# EAGLE design Controller (EAGLE 6.2)
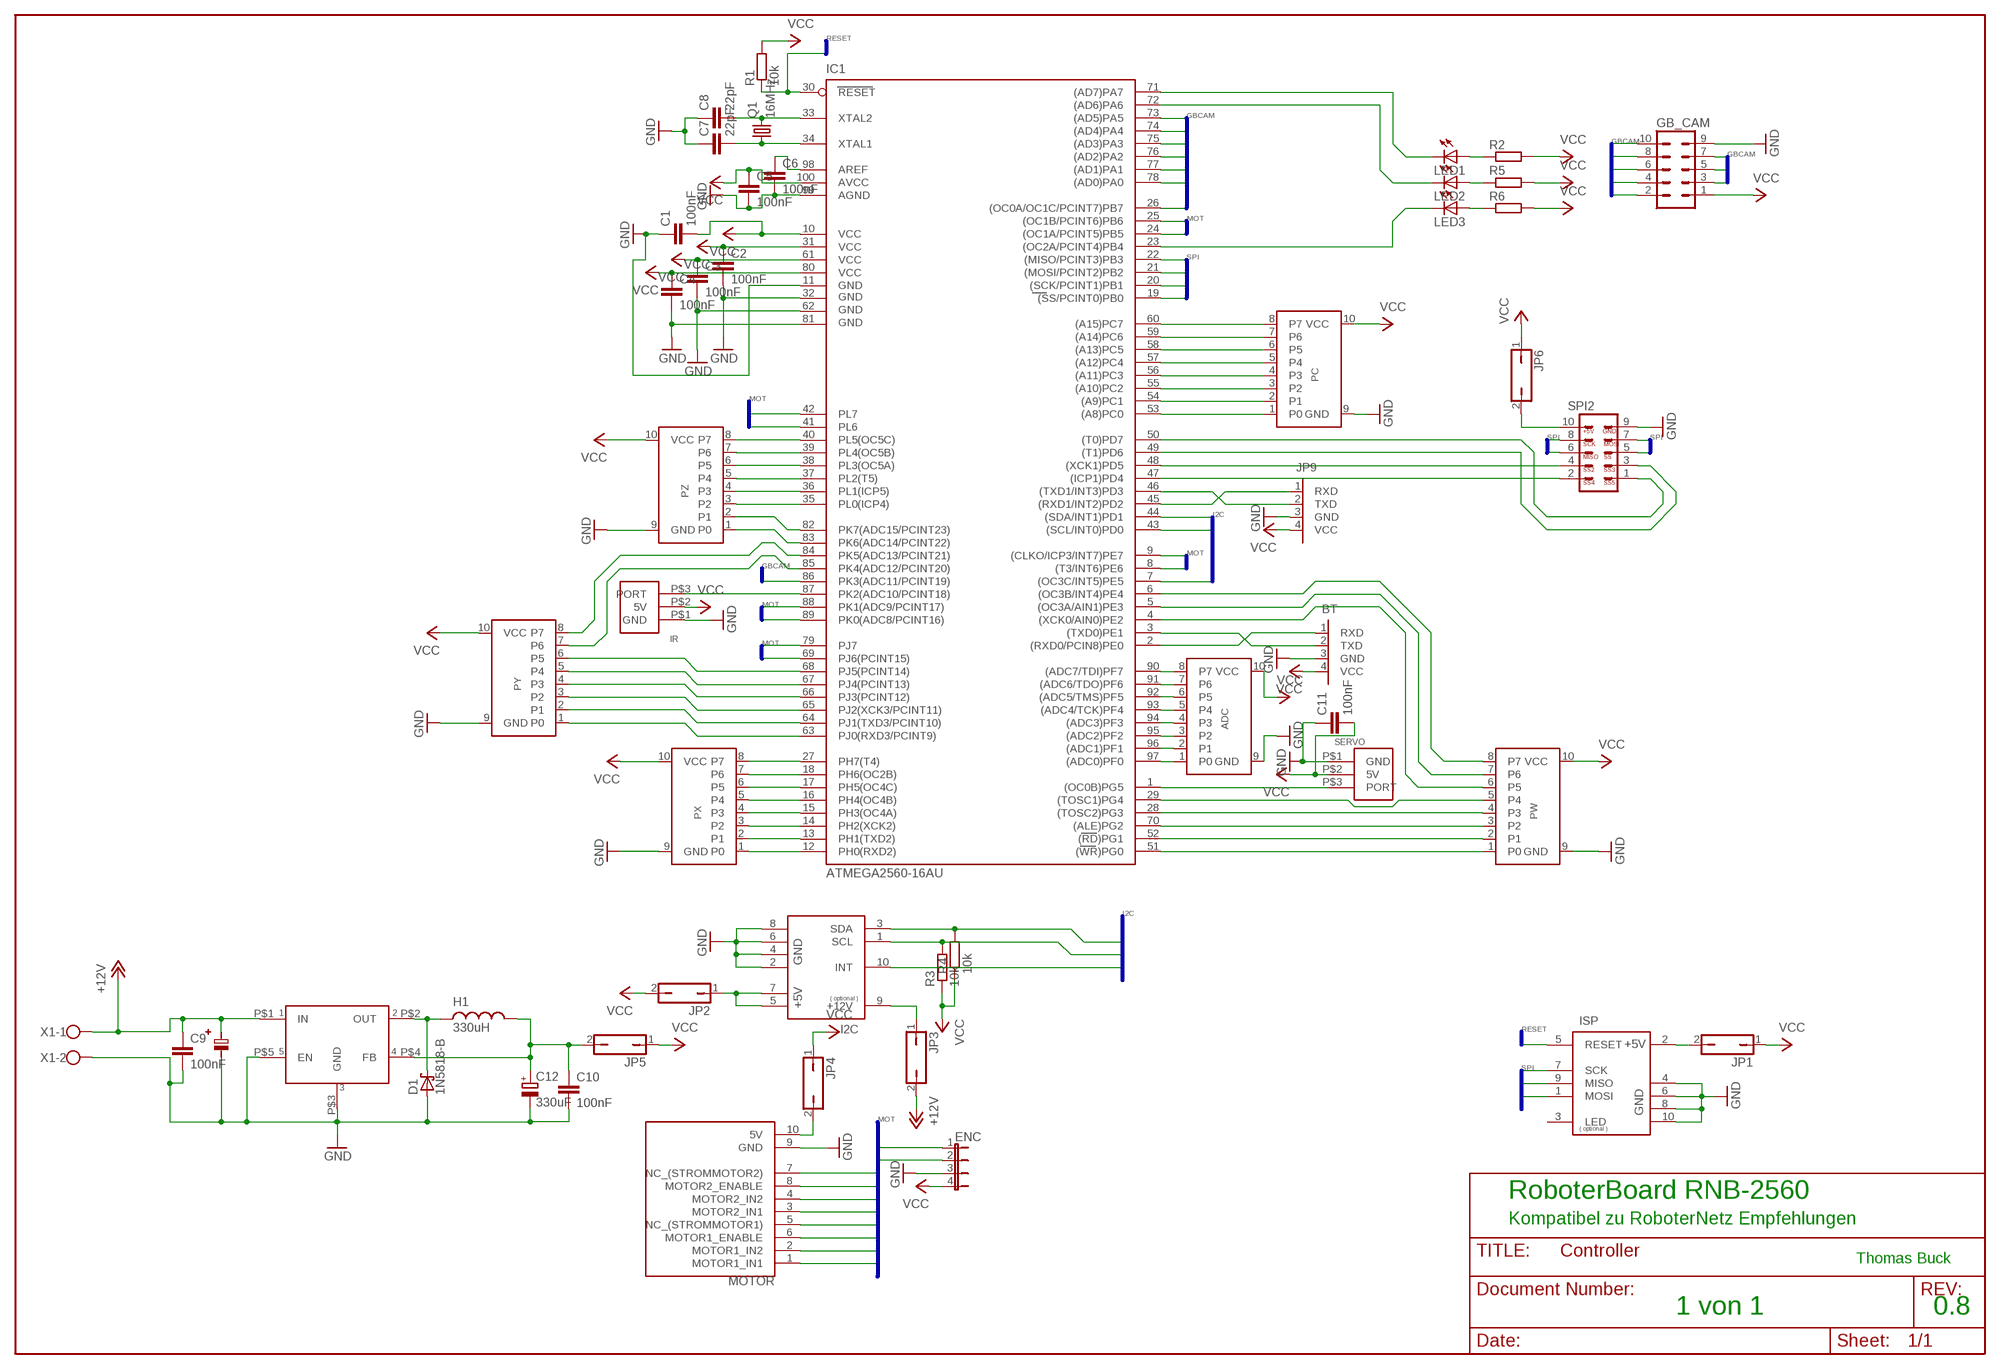
[diagram p0: schematic, sheet 1]

## Parts
ADC  PORT  [ML10]
BT  RS232_TTL  [1X04]
C1  100nF  C-EUC0603  [C0603]
C2  100nF  C-EUC0603  [C0603]
C3  100nF  C-EUC0603  [C0603]
C4  100nF  C-EUC0603  [C0603]
C5  100nF  C-EUC0603  [C0603]
C6  100nF  C-EUC0603  [C0603]
C7  22pF  C-EUC0603  [C0603]
C8  22pF  C-EUC0603  [C0603]
C9  100nF  C-EUC0603  [C0603]
C10  100nF  C-EUC0603  [C0603]
C11  100nF  C-EUC0603  [C0603]
C12  330uF  CPOL-EUF  [PANASONIC_F]
D1  1N5818-B  [DO41-7.6]
ENC  JP4E  [JP4]
GB_CAM  ML10  [ML10]
H1  330uH  PISR_SPULE  [PISR]
I2C  I2C  [ML10]
IC1  ATMEGA2560-16AU  [TQFP100]
IR  UNIPORT3POL  [1X3SERVO]
ISP  AVR-ISP  [ML10]
JP1  JP1Q  [JP1]
JP2  JP1Q  [JP1]
JP3  JP1Q  [JP1]
JP4  JP1Q  [JP1]
JP5  JP1Q  [JP1]
JP6  JP1Q  [JP1]
JP9  RS232_TTL  [1X04]
LED1  LEDCHIP-LED0603  [CHIP-LED0603]
LED2  LEDCHIP-LED0603  [CHIP-LED0603]
LED3  LEDCHIP-LED0603  [CHIP-LED0603]
LM2576-5  LM2576  [TO-220]
MOTOR  MOTORSTTCKER10POLRNNORM  [ML10]
PC  PORT  [ML10]
PW  PORT  [ML10]
PX  PORT  [ML10]
PY  PORT  [ML10]
PZ  PORT  [ML10]
Q1  16MHz  CRYSTALHC49S  [HC49/S]
R1  10k  R-EU_R0603  [R0603]
R2  R-EU_R0603  [R0603]
R3  10k  R-EU_R0603  [R0603]
R4  10k  R-EU_R0603  [R0603]
R5  R-EU_R0603  [R0603]
R6  R-EU_R0603  [R0603]
SERVO  UNIPORT3POL  [1X3SERVO]
SPI2  SPISTECKER  [ML10]
U$1  100uF  ELKO  [ELKO_SMD_6.5]
X1  W237-102  [W237-102]

## Nets
+12V: C9.1 JP3.2 LM2576-5.P$1(IN) U$1.P$2 X1.1
ANALOG: GB_CAM.8 IC1.86(PK3(ADC11/PCINT19))
CLK: GB_CAM.6 IC1.77((AD1)PA1)
DATA: GB_CAM.3 IC1.74((AD4)PA4)
DATASET: GB_CAM.4 IC1.75((AD3)PA3)
DREHL: ENC.1 IC1.9((CLKO/ICP3/INT7)PE7)
DREHR: ENC.2 IC1.8((T3/INT6)PE6)
GND: ADC.9(GND) BT.3(GND) C1.1 C2.2 C3.2 C4.2 C5.2 C6.2 C7.1 C8.1 C9.2 C10.2 C11.1 C12.- D1.A ENC.3 GB_CAM.9 I2C.2(GND) I2C.4(GND) I2C.6(GND) I2C.8(GND) IC1.11(GND) IC1.32(GND1) IC1.62(GND2) IC1.81(GND3) IC1.99(AGND) IR.P$1(GND) ISP.4(GND) ISP.6(GND) ISP.8(GND) ISP.10(GND) JP9.3(GND) LM2576-5.P$3(GND) LM2576-5.P$5(EN) MOTOR.9(GND) PC.9(GND) PW.9(GND) PX.9(GND) PY.9(GND) PZ.9(GND) SERVO.P$1(GND) SPI2.9 U$1.P$1 X1.2
IN1L: IC1.42(PL7) MOTOR.1(MOTOR1_IN1)
IN1R: IC1.79(PJ7) MOTOR.3(MOTOR2_IN1)
IN2L: IC1.41(PL6) MOTOR.2(MOTOR1_IN2)
IN2R: IC1.69(PJ6(PCINT15)) MOTOR.4(MOTOR2_IN2)
INT: I2C.10(INT) IC1.7((OC3C/INT5)PE5)
MISO: IC1.22((MISO/PCINT3)PB3) ISP.9(MISO) SPI2.6
MOSI: IC1.21((MOSI/PCINT2)PB2) ISP.1(MOSI) SPI2.7
N$1: IC1.87(PK2(ADC10/PCINT18)) IR.P$3(PORT)
N$2: C6.1 IC1.98(AREF)
N$3: C8.2 IC1.33(XTAL2) Q1.2
N$4: C7.2 IC1.34(XTAL1) Q1.1
N$5: IC1.1((OC0B)PG5) SERVO.P$3(PORT)
N$6: IC1.60((A15)PC7) PC.8(P7)
N$7: IC1.59((A14)PC6) PC.7(P6)
N$8: IC1.58((A13)PC5) PC.6(P5)
N$9: IC1.57((A12)PC4) PC.5(P4)
N$10: IC1.56((A11)PC3) PC.4(P3)
N$11: IC1.55((A10)PC2) PC.3(P2)
N$12: IC1.54((A9)PC1) PC.2(P1)
N$13: IC1.53((A8)PC0) PC.1(P0)
N$14: IC1.12(PH0(RXD2)) PX.1(P0)
N$15: IC1.13(PH1(TXD2)) PX.2(P1)
N$16: IC1.14(PH2(XCK2)) PX.3(P2)
N$17: IC1.15(PH3(OC4A)) PX.4(P3)
N$18: IC1.16(PH4(OC4B)) PX.5(P4)
N$19: IC1.17(PH5(OC4C)) PX.6(P5)
N$20: IC1.18(PH6(OC2B)) PX.7(P6)
N$21: IC1.27(PH7(T4)) PX.8(P7)
N$22: IC1.40(PL5(OC5C)) PZ.8(P7)
N$23: IC1.39(PL4(OC5B)) PZ.7(P6)
N$24: IC1.38(PL3(OC5A)) PZ.6(P5)
N$25: IC1.37(PL2(T5)) PZ.5(P4)
N$26: IC1.36(PL1(ICP5)) PZ.4(P3)
N$27: IC1.35(PL0(ICP4)) PZ.3(P2)
N$28: IC1.82(PK7(ADC15/PCINT23)) PZ.2(P1)
N$29: IC1.83(PK6(ADC14/PCINT22)) PZ.1(P0)
N$30: IC1.63(PJ0(RXD3/PCINT9)) PY.1(P0)
N$31: IC1.64(PJ1(TXD3/PCINT10)) PY.2(P1)
N$32: IC1.65(PJ2(XCK3/PCINT11)) PY.3(P2)
N$33: IC1.66(PJ3(PCINT12)) PY.4(P3)
N$34: IC1.67(PJ4(PCINT13)) PY.5(P4)
N$35: IC1.68(PJ5(PCINT14)) PY.6(P5)
N$36: IC1.85(PK4(ADC12/PCINT20)) PY.7(P6)
N$37: IC1.84(PK5(ADC13/PCINT21)) PY.8(P7)
N$38: IC1.51((WR)PG0) PW.1(P0)
N$39: IC1.52((RD)PG1) PW.2(P1)
N$40: IC1.70((ALE)PG2) PW.3(P2)
N$41: IC1.28((TOSC2)PG3) PW.4(P3)
N$42: IC1.29((TOSC1)PG4) PW.5(P4)
N$43: IC1.4((XCK0/AIN0)PE2) PW.6(P5)
N$44: IC1.5((OC3A/AIN1)PE3) PW.7(P6)
N$45: IC1.6((OC3B/INT4)PE4) PW.8(P7)
N$46: JP6.2 SPI2.10
N$47: IC1.47((ICP1)PD4) SPI2.2
N$48: IC1.48((XCK1)PD5) SPI2.4
N$49: IC1.50((T0)PD7) SPI2.1
N$50: IC1.23((OC2A/PCINT4)PB4) LED3.C
N$51: IC1.72((AD6)PA6) LED2.C
N$52: IC1.71((AD7)PA7) LED1.C
N$53: IC1.49((T1)PD6) SPI2.3
N$54: ISP.2(+5V) JP1.2
N$55: I2C.5(+5V) I2C.7(+5V) JP2.1
N$56: I2C.9(+12V) JP3.1
N$57: JP4.2 MOTOR.10(5V)
N$58: ADC.8(P7) IC1.90((ADC7/TDI)PF7)
N$59: LED1.A R2.1
N$60: LED2.A R5.1
N$61: LED3.A R6.1
N$62: ADC.7(P6) IC1.91((ADC6/TDO)PF6)
N$63: ADC.6(P5) IC1.92((ADC5/TMS)PF5)
N$64: D1.C H1.P$1 LM2576-5.P$2(OUT)
N$65: ADC.5(P4) IC1.93((ADC4/TCK)PF4)
N$66: ADC.4(P3) IC1.94((ADC3)PF3)
N$67: ADC.3(P2) IC1.95((ADC2)PF2)
N$68: ADC.2(P1) IC1.96((ADC1)PF1)
N$69: ADC.1(P0) IC1.97((ADC0)PF0)
N$71: IC1.46((TXD1/INT3)PD3) JP9.2(TXD)
N$72: IC1.45((RXD1/INT2)PD2) JP9.1(RXD)
N$80: C10.1 C12.+ H1.P$2 JP5.2 LM2576-5.P$4(FB)
PWML: IC1.25((OC1B/PCINT6)PB6) MOTOR.6(MOTOR1_ENABLE)
PWMR: IC1.24((OC1A/PCINT5)PB5) MOTOR.8(MOTOR2_ENABLE)
READIMG: GB_CAM.7 IC1.78((AD0)PA0)
RESET: IC1.30(RESET) ISP.5(RESET) R1.1
RX: BT.1(RXD) IC1.2((RXD0/PCIN8)PE0)
SCK: IC1.20((SCK/PCINT1)PB1) ISP.7(SCK) SPI2.8
SCL: I2C.1(SCL) IC1.43((SCL/INT0)PD0) R3.2
SDA: I2C.3(SDA) IC1.44((SDA/INT1)PD1) R4.2
SENSL: IC1.88(PK1(ADC9/PCINT17)) MOTOR.5(NC_(STROMMOTOR1))
SENSR: IC1.89(PK0(ADC8/PCINT16)) MOTOR.7(NC_(STROMMOTOR2))
SERVO: GB_CAM.10 IC1.26((OC0A/OC1C/PCINT7)PB7)
SS: IC1.19((SS/PCINT0)PB0) SPI2.5
START: GB_CAM.2 IC1.73((AD5)PA5)
SYSRES: GB_CAM.5 IC1.76((AD2)PA2)
TX: BT.2(TXD) IC1.3((TXD0)PE1)
VCC: ADC.10(VCC) BT.4(VCC) C1.2 C2.1 C3.1 C4.1 C5.1 C11.2 ENC.4 GB_CAM.1 IC1.10(VCC) IC1.31(VCC1) IC1.61(VCC2) IC1.80(VCC3) IC1.100(AVCC) IR.P$2(5V) JP1.1 JP2.2 JP4.1 JP5.1 JP6.1 JP9.4(VCC) PC.10(VCC) PW.10(VCC) PX.10(VCC) PY.10(VCC) PZ.10(VCC) R1.2 R2.2 R3.1 R4.1 R5.2 R6.2 SERVO.P$2(5V)
Unconnected: ISP.3(LED)

## Buses
PWML,PWMR,IN1L,IN2L,IN1R,IN2R,DREHL,DREHR,SENSL,SENSR
SDA,SCL,INT
SS,MOSI,MISO,SCK
RESET
START,DATA,DATASET,SYSRES,CLK,READIMG,ANALOG,SERVO

## Notes on the sheet
- RESET
- GBCAM
- GBCAM
- GBCAM
- MOT
- SPI
- MOT
- SPI | SPI
- I2C
- MOT
- GBCAM
- MOT
- MOT
- I2C
- RESET
- SPI
- MOT
- RoboterBoard RNB-2560
- Kompatibel zu RoboterNetz Empfehlungen
- Thomas Buck
- 1 von 1 | 0.8

## Library data of the parts
ADC PC PW PX PY PZ = 0-roboternetz-definitionen:PORT: Datenportstecker Kompatibel zu den Steckern des STK500
BT JP9 = 0-roboternetz-definitionen:RS232_TTL: RS232 Stecker TTL-Pegel ( für externe Pegelwandler für RS485 o.ä. )
C1-C11 = resistor:C-EU: CAPACITOR, European symbol
C12 = resistor:CPOL-EU: POLARIZED CAPACITOR, European symbol
D1 = diode:1N581*: 1.0A SCHOTTKY BARRIER RECTIFIER Source: http://www.diodes.com/datasheets/ds23001.pdf
ENC = jumper:JP4E: JUMPER
GB_CAM = con-harting-ml:ML10: HARTING; OC_FARNELL: unknown; OC_NEWARK: unknown
H1 = 0-xythobuz:PISR_SPULE: SMD Spule/Drossel
I2C = 0-roboternetz-definitionen:I2C: I2C Bus Stecker Ein universeller serieller Bus für Erweiterungen. Der Bus hat den Vorteil das zwei Leitungen ausreichen und keine festen Taktraten und Zyklen beachtet werden müssen. Zahlreichen integrierten Schaltkreise ( wie Porterweiterungen, LCD-Treiber, usw. ) nutzen diesen Bus. Am I2C-Bus können mehrere Karten/Bausteine angeschlossen (durchgeschleift) werden, da jeder Baustein seine Slave Adresse besitzt. Der hier definierte Standard ist kompatibel ( wenn man Pin 10 unbeschaltet lässt ) zum Elektor-Standard ( Elektronik Zeitrschrift ).
IC1 = 0-atmel-2005:ATMEGA*: MICROCONTROLLER 64/128/256 Kbytes FLASH 4 Kbytes EEPROM 8 Kbytes SRAM 86 General Purpose I/O pins 12-channels16-bit PWM 4 x Serial USARTs 16-channels 10-bit A/D
IR SERVO = 0-robotikhardware:UNIPORT3POL
ISP = 0-roboternetz-definitionen:AVR-ISP: ISP ( In System Programming ) Stecker für AVRs Über diesen Anschluß kann ein AVR mit einem Standard ISP-Kabel direkt an einen Parallelport des PC´s angeschlossen und programmiert werden. Die Belegung des ISP-Anschlusses ist zu dem weit verbreitetet STK200 Programmier Dongle kompatibel. Ein entsprechender Dongle ist über zahlreiche Händler lieferbar. Es gibt aber auch viele Selbstbauanleitungen im Internet.
JP1-JP6 = jumper:JP1Q: JUMPER
LED1-LED3 = led:LED: LED OSRAM: - CHIPLED LG R971, LG N971, LY N971, LG Q971, LY Q971, LO R971, LY R971 LH N974, LH R974 LS Q976, LO Q976, LY Q976 LO Q996 - Hyper CHIPLED LW Q18S LB Q993, LB Q99A, LB R99A - SideLED LS A670, LO A670, LY A670, LG A670, LP A670 LB A673, LV A673, LT A673, LW A673 LH A674 LY A675 LS A676, LA A676, LO A676, LY A676, LW A676 LS A679, LY A679, LG A679 - Hyper Micro SIDELED® LS Y876, LA Y876, LO Y876, LY Y876 LT Y87S - SmartLED LW L88C, LW L88S LB L89C, LB L89S, LG L890 LS L89K, LO L89K, LY L89K LS L896, LA L896, LO L896, LY L896 - TOPLED LS T670, LO T670, LY T670, LG T670, LP T670 LSG T670, LSP T670, LSY T670, LOP T670, LYG T670 LG T671, LOG T671, LSG T671 LB T673, LV T673, LT T673, LW T673 LH T674 LS T676, LA T676, LO T676, LY T676, LB T676, LH T676, LSB T676, LW T676 LB T67C, LV T67C, LT T67C, LS T67K, LO T67K, LY T67K, LW E67C LS E67B, LA E67B, LO E67B, LY E67B, LB E67C, LV E67C, LT E67C LW T67C LS T679, LY T679, LG T679 LS T770, LO T770, LY T770, LG T770, LP T770 LB T773, LV T773, LT T773, LW T773 LH T774 LS E675, LA E675, LY E675, LS T675 LS T776, LA T776, LO T776, LY T776, LB T776 LHGB T686 LT T68C, LB T68C - Hyper Mini TOPLED® LB M676 - Mini TOPLED Santana® LG M470 LS M47K, LO M47K, LY M47K Source: http://www.osram.convergy.de LUXEON: - LUMILED® LXK2-PW12-R00, LXK2-PW12-S00, LXK2-PW14-U00, LXK2-PW14-V00 LXK2-PM12-R00, LXK2-PM12-S00, LXK2-PM14-U00 LXK2-PE12-Q00, LXK2-PE12-R00, LXK2-PE12-S00, LXK2-PE14-T00, LXK2-PE14-U00 LXK2-PB12-K00, LXK2-PB12-L00, LXK2-PB12-M00, LXK2-PB14-N00, LXK2-PB14-P00, LXK2-PB14-Q00 LXK2-PR12-L00, LXK2-PR12-M00, LXK2-PR14-Q00, LXK2-PR14-R00 LXK2-PD12-Q00, LXK2-PD12-R00, LXK2-PD12-S00 LXK2-PH12-R00, LXK2-PH12-S00 LXK2-PL12-P00, LXK2-PL12-Q00, LXK2-PL12-R00 Source: www.luxeon.com KINGBRIGHT: KA-3528ASYC Source: www.kingbright.com
LM2576-5 = 0-xythobuz:LM2576: LM2576 Schaltregler ´
MOTOR = 0-robotikhardware:MOTORSTTCKER10POLRNNORM
Q1 = crystal:CRYSTAL: CRYSTAL; OC_FARNELL: 1667008; OC_NEWARK: unknown
R1-R6 = resistor:R-EU_: RESISTOR, European symbol
SPI2 = 0-robotikhardware:SPISTECKER
U$1 = 0-xythobuz:ELKO: Elektrolyt Kondensator
X1 = con-wago-500:W237-102: WAGO SCREW CLAMP; MPN: 237-102; OC_FARNELL: unknown; OC_NEWARK: 70K9898

## Net classes
1 Power4A: width 1.143 mm
2 Power2A: width 0.762 mm
3 Power3A: width 1.016 mm

## Board
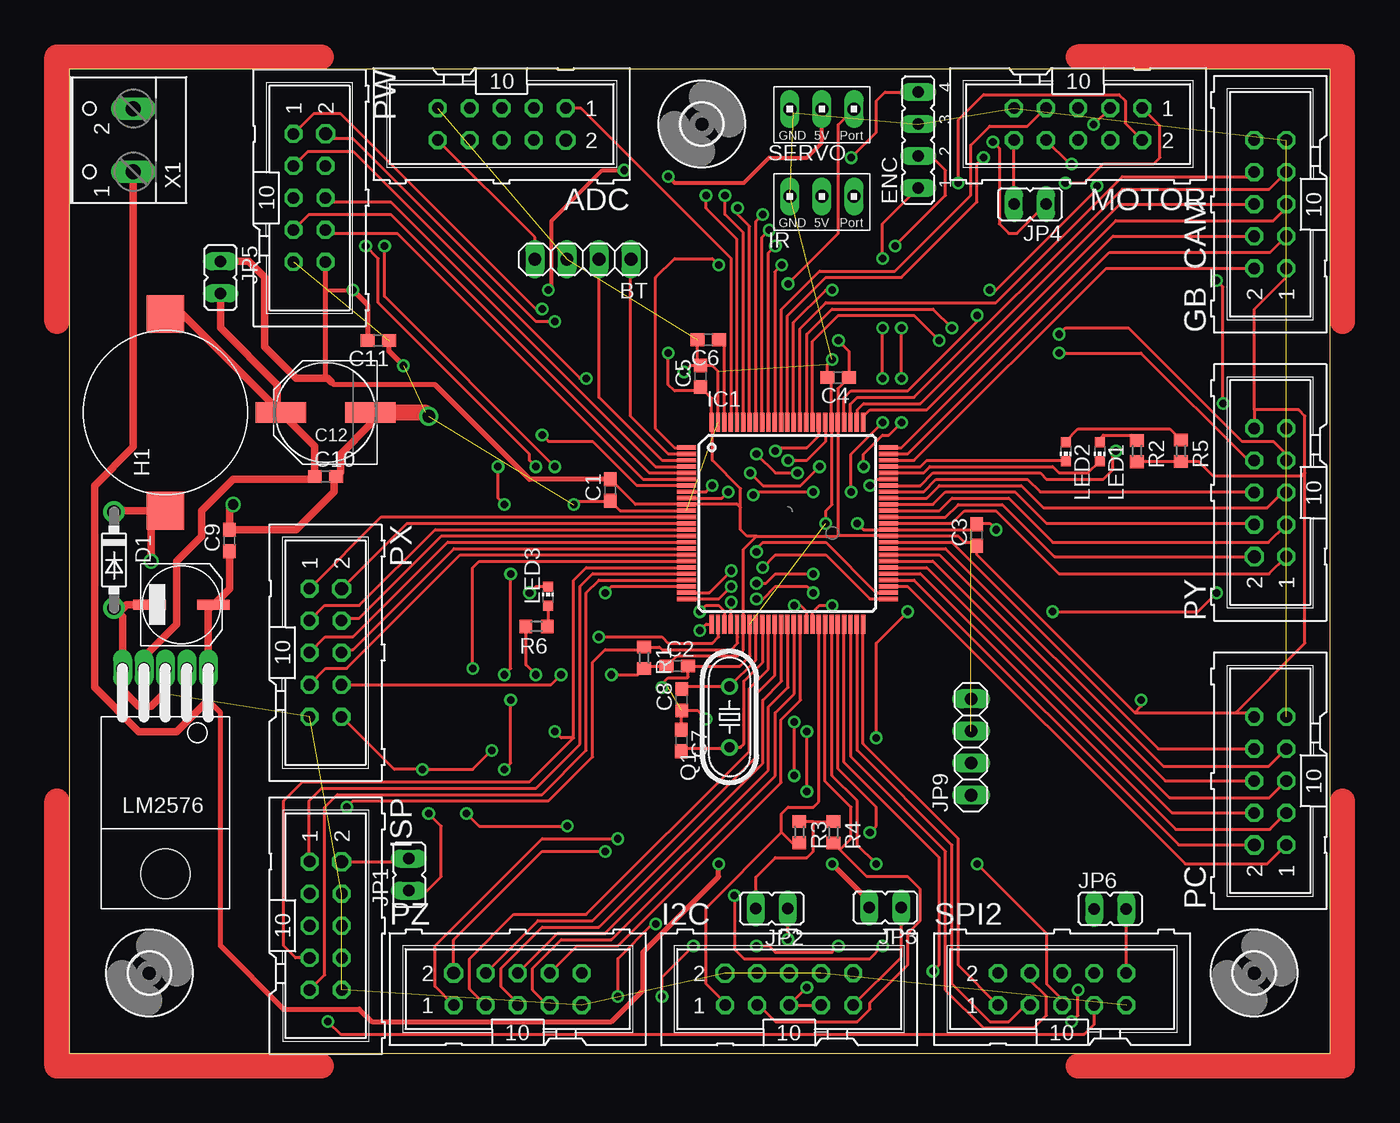
[diagram p1: board, top side]
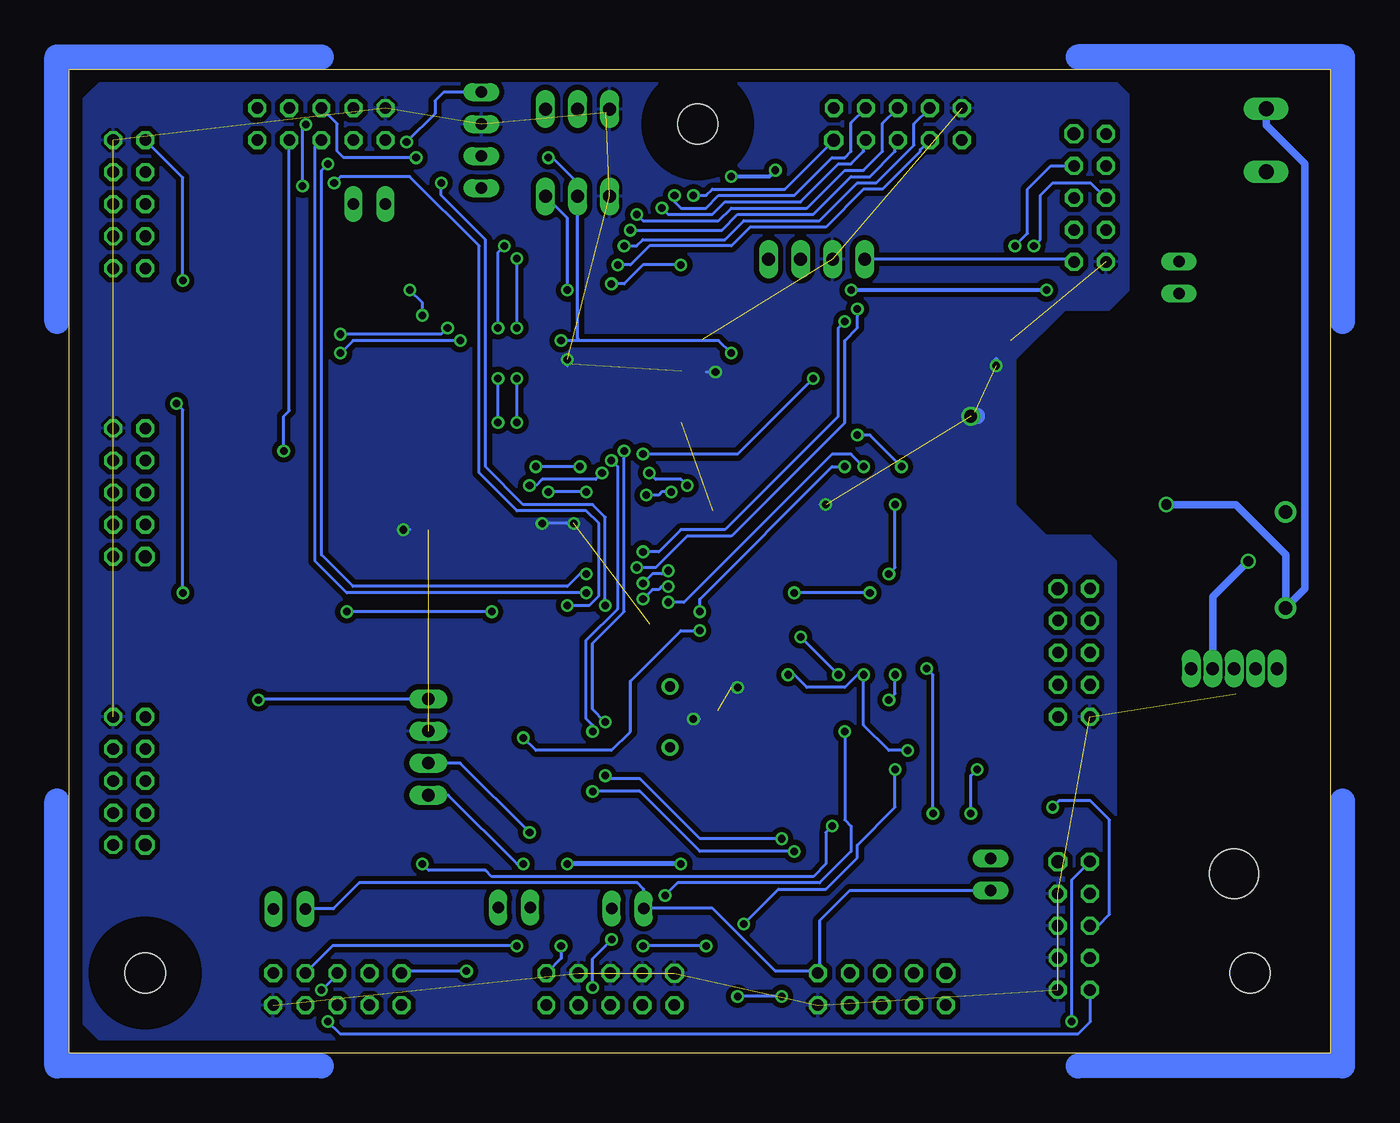
[diagram p2: board, bottom side, seen from below]

Size 100 x 78 mm. Coordinates in mm from the lower left corner, seen from the top.
Outline: 0,0 100,0 100,78 0,78 0,0
Copper layers (1*16): Top 0.035mm / dielectric 1.5mm / Bottom 0.035mm
Design rules: minimum track width 0.25mm, minimum drill 0.6mm, track to track 0.15mm, track to pad 0.15mm, pad to pad 0.15mm, via to via 0.15mm, smd to smd 0.15mm, copper to edge 40mil, drill to drill 8mil, minimum pad ring 10mil, minimum via ring 8mil, stop-mask expansion 4mil, vias tented up to drill 0mil, thermal gap 10mil

### Footprints (pad centres in the part's own frame; a part is rotated, then mirrored left to right if it is on the bottom)
ML10 = drill 0.914 pad 1.422 octagon: 1 -5.08,-1.27; 3 -2.54,-1.27; 4 -2.54,1.27 | drill 1.016 pad 1.422 octagon: 2 -5.08,1.27 | drill 0.914 octagon: 5 0,-1.27; 6 0,1.27; 7 2.54,-1.27; 8 2.54,1.27; 9 5.08,-1.27; 10 5.08,1.27
1X04 = drill 1.016 long: 1 -3.81,0; 2 -1.27,0; 3 1.27,0; 4 3.81,0
C0603 = smd 1.1 x 1: 1 -0.85,0; 2 0.85,0
PANASONIC_F = smd 4 x 1.6: + 3.55,0; - -3.55,0
DO41-7.6 = drill 1.1 pad 1.7: A 3.81,0; C -3.81,0
JP4 = drill 0.914 long: 1 -3.81,0; 2 -1.27,0; 3 1.27,0; 4 3.81,0
ML10' = drill 0.914 octagon: 1 -5.08,-1.27; 2 -5.08,1.27; 3 -2.54,-1.27; 4 -2.54,1.27; 5 0,-1.27; 6 0,1.27; 7 2.54,-1.27; 8 2.54,1.27; 9 5.08,-1.27; 10 5.08,1.27
PISR = smd 3 x 3: P$1 -7.8,0; P$2 7.8,0
TQFP100 = smd 1.5 x 0.35: 1 -8,6; 2 -8,5.5; 3 -8,5; 4 -8,4.5; 5 -8,4; 6 -8,3.5; 7 -8,3; 8 -8,2.5; 9 -8,2; 10 -8,1.5; 11 -8,1; 12 -8,0.5; 13 -8,0; 14 -8,-0.5; 15 -8,-1; 16 -8,-1.5; 17 -8,-2; 18 -8,-2.5; 19 -8,-3; 20 -8,-3.5; 21 -8,-4; 22 -8,-4.5; 23 -8,-5; 24 -8,-5.5; 25 -8,-6; 51 8,-6; 52 8,-5.5; 53 8,-5; 54 8,-4.5; 55 8,-4; 56 8,-3.5; 57 8,-3; 58 8,-2.5; 59 8,-2; 60 8,-1.5; 61 8,-1; 62 8,-0.5; 63 8,0; 64 8,0.5; 65 8,1; 66 8,1.5; 67 8,2; 68 8,2.5; 69 8,3; 70 8,3.5; 71 8,4; 72 8,4.5; 73 8,5; 74 8,5.5; 75 8,6 | smd 0.35 x 1.5: 26 -6,-8; 27 -5.5,-8; 28 -5,-8; 29 -4.5,-8; 30 -4,-8; 31 -3.5,-8; 32 -3,-8; 33 -2.5,-8; 34 -2,-8; 35 -1.5,-8; 36 -1,-8; 37 -0.5,-8; 38 0,-8; 39 0.5,-8; 40 1,-8; 41 1.5,-8; 42 2,-8; 43 2.5,-8; 44 3,-8; 45 3.5,-8; 46 4,-8; 47 4.5,-8; 48 5,-8; 49 5.5,-8; 50 6,-8; 76 6,8; 77 5.5,8; 78 5,8; 79 4.5,8; 80 4,8; 81 3.5,8; 82 3,8; 83 2.5,8; 84 2,8; 85 1.5,8; 86 1,8; 87 0.5,8; 88 0,8; 89 -0.5,8; 90 -1,8; 91 -1.5,8; 92 -2,8; 93 -2.5,8; 94 -3,8; 95 -3.5,8; 96 -4,8; 97 -4.5,8; 98 -5,8; 99 -5.5,8; 100 -6,8
1X3SERVO = drill 1.016 long: P$1 -2.54,0; P$2 0,0; P$3 2.54,0
JP1 = drill 0.914 long: 1 0,-1.27; 2 0,1.27
CHIP-LED0603 = smd 0.8 x 0.8: A 0,-0.75; C 0,0.75
TO-220 = drill 1 long: P$1 -3.404,-8.89; P$2 -1.702,-8.89; P$3 0,-8.89; P$4 1.702,-8.89; P$5 3.404,-8.89 | hole 3.912: 0,7.366
HC49/S = drill 0.813: 1 -2.413,0; 2 2.413,0
R0603 = smd 1 x 1.1: 1 -0.85,0; 2 0.85,0
ELKO_SMD_6.5 = smd 2.6 x 0.8: P$1 -2.54,0; P$2 2.54,0
3,2 = hole 3.2: 0,0
W237-102 = drill 1.194 long: 1 -2.5,-1.27; 2 2.5,-1.27

### Placement (x,y rotation side)
ADC  34.29,73.66 180 top
BT  40.73,62.94 180 top
C1  42.91,44.64 90 top
C2  48.22,30.69 0 top
C3  71.96,41.07 90 top
C4  60.98,53.56 180 top
C5  50.06,53.67 90 top
C6  50.68,56.56 180 top
C7  48.54,24.78 270 top
C8  48.56,28.02 90 top
C9  12.7,40.64 90 top
C10  20.32,45.72 0 top
C11  24.5,56.5 180 top
C12  20.32,50.8 180 top
D1  3.54,39.1 270 top
ENC  67.31,72.39 90 top
GB_CAM  [ML10']  95.25,67.31 90 top
H1  7.62,50.8 90 top
I2C  57.09,5.07 0 top
IC1  56.95,42.01 0 top
IR  59.69,67.93 0 top
ISP  20.33,10.1 270 top
JP1  26.93,14.16 0 top
JP2  55.72,11.48 90 top
JP3  64.72,11.56 90 top
JP4  76.2,67.31 90 top
JP5  12,61.5 180 top
JP6  82.55,11.43 270 top
JP9  71.52,24.27 90 top
LED1  81.72,47.68 180 top
LED2  79.03,47.68 180 top
LED3  37.96,36.22 0 top
LM2576-5  7.62,21.59 180 top
MOTOR  [ML10']  80.01,73.66 180 top
PC  95.25,21.59 90 top
PW  19.05,67.81 270 top
PX  20.32,31.75 270 top
PY  95.25,44.45 90 top
PZ  35.56,5.08 0 top
Q1  52.36,26.66 90 top
R1  45.59,31.35 270 top
R2  84.67,47.74 270 top
R3  57.89,17.53 270 top
R4  60.59,17.51 270 top
R5  88.17,47.75 270 top
R6  37.06,33.83 180 top
SERVO  59.69,74.85 0 top
SPI2  [ML10']  78.74,5.08 0 top
U$1  8.89,35.56 0 top
U$2  [3,2]  6.35,6.35 0 top
U$3  [3,2]  50.16,73.66 0 top
U$4  [3,2]  93.98,6.35 0 top
X1  3.81,72.39 90 top

### Tracks (layer width: path | path; a pad name or v marks a point on that pad's centre or on a via)
+12V  (via drill 0.6)
  Top 0.406: JP3.2 63.45,12.05 v60.5,15 | v51.5,15 51.5,14 45.5,8 45.5,5 43,2.5 24,2.5 23,3.5 17,3.5 12,8.5 12,27 11,28
  Top 0.61: X1.1 5.08,48.08 2,45 2,29 5.5,25.5 8.5,25.5 11,28 11,30.46 LM2576-5.P$1 11.02,35.15 U$1.P$2 12.7,36.83 C9.1
  Bottom 0.406: v51.5,15 v60.5,15
ANALOG
  Top 0.25: IC1.86 57.95,57.45 60,59.5 73.5,59.5 83.5,69.5 93.63,69.5 GB_CAM.8
CLK
  Top 0.25: GB_CAM.6 83.31,67.31 67.5,51.5 63,51.5 62.5,51 62.5,50.06 IC1.77
DATA
  Top 0.25: IC1.74 66.51,47.51 82.5,63.5 95.25,63.5 GB_CAM.3
DATASET
  Top 0.25: GB_CAM.4 82.77,64.77 66,48 IC1.75
DREHL  (via drill 0.6)
  Top 0.25: IC1.9 51.76,44.01 v52.25,44.5 | v54.25,44.25 54.5,44.5 v59,44.5 | v62,44.5 62,47.5 v64.5,50 | v64.5,53.5 v64.5,57.5 | v64.5,63 64.5,65.77 ENC.1
  Bottom 0.25: v52.25,44.5 53,44.5 53.25,44.25 v54.25,44.25 | v59,44.5 v62,44.5 | v64.5,50 v64.5,53.5 | v64.5,57.5 v64.5,63
DREHR  (via drill 0.6)
  Top 0.25: IC1.8 50.51,44.51 v51,45 | v54,46 55,45 58,45 v59.5,46.5 | v63,46.5 63,47.5 64.5,49 65,49 v66,50 | v66,53.5 v66,57.5 | v65.5,64 69.5,68 69.5,70 68.5,71 67.43,71 ENC.2
  Bottom 0.25: v51,45 51.5,45.5 53.5,45.5 v54,46 | v59.5,46.5 v63,46.5 | v66,50 v66,53.5 | v66,57.5 66,63.5 v65.5,64
GND  (via drill 0.6, 0.8, 1)  (28 unrouted)
  Top 0.25: IC1.62 71.55,41.51 C3.2 | IC1.62 71.51,41.51 72,42 73,42 v73.5,41.5 | SERVO.P$1 57.42,74.58 | C7.1 48.56,25.65 C8.1 49.83,27.17 v50.5,26.5 | IC1.32 54,33.96 54,31.5 53.19,30.69 C2.2 49.07,29.82 49,29.75 47.5,29.75 47,29.25 v47,29 | IC1.11 43.69,43.01 C1.1 42.96,43.79 43,43.75 40.25,43.75 v40,43.5 | IC1.99 51.45,54.05 51,54.5 50.08,54.5 | 50.08,54.5 C5.2 49.83,54.75 C6.2 | v60.5,55 60.13,54.63 C4.2 60.45,53.24 IC1.81 60.5,49.96 60.5,43.5 60,43 v60,42 | 50.08,54.5 49.25,54.5 v48.75,54 | C10.2 21,45.89 | IC1.62 62.99,41.51 v62.5,42
  Top 0.406: C11.1 25.35,55.65 v26.5,54.5
  Top 0.61: 3.92,34.91 4.22,34.61 LM2576-5.P$5 4.22,28.78 5.5,27.5 6.5,27.5 7.5,28.5 7.5,30.36 LM2576-5.P$3 | 3.92,34.91 D1.A | U$1.P$1 4.56,35.56 3.92,34.91 | v13,43.5 12.7,43.2 C9.2 17.99,41.49 21,44.5 21,45.55 C10.2 21.5,46.05 21.5,47.5 23.87,49.87 C12.-
  Top 1.27: C12.- 28.2,50.8 v28.5,50.5
  Bottom 0.25: v73.5,41.5 73,41.5 | v50.5,26.5 50,26.5 | v47,29 47.5,29 | v60.5,55 60.5,54.5 | v48.75,54 49.5,54 | v40,43.5 40.5,43.5 | v60,42 v62.5,42
  Bottom 0.406: v26.5,54.5 26.5,55
  Bottom 0.61: v13,43.5 7.5,43.5 3.5,39.5 3.5,35.33 D1.A 2,36.83 2,70.5 5.08,73.58 X1.2
  Bottom 1.27: v28.5,50.5 28,50.5
  pour Bottom (isolate 0.406): 17,39 19,41 22.5,41 25,43.5 25,55 21,59 17.5,59 16,60.5 16,76 17.5,77.5 97,77.5 99,75.5 99,2.5 97.5,1 17,1
IN1L  (via drill 0.6)
  Top 0.25: IC1.42 58.95,34.95 59.5,35.5 v60.5,35.5 | v79,69 80.5,69 82,70.5 86,70.5 86.5,71 86.5,73.52 MOTOR.1
  Bottom 0.25: v60.5,35.5 58.75,35.5 58,36.25 58,42 59,43 64.5,43 67.5,46 67.5,64 73,69.5 78.5,69.5 v79,69
IN1R  (via drill 0.6)
  Top 0.25: IC1.79 61.45,51.95 62,52.5 66.5,52.5 72,58 v72,58.5 | v73,60.5 73.5,60.5 81.5,68.5 v81.5,68.75 | v81.25,73.63 MOTOR.3
  Bottom 0.25: v72,58.5 72,59.5 v73,60.5 | v81.5,68.75 81.5,73.38 v81.25,73.63
IN2L  (via drill 0.6)
  Top 0.25: IC1.41 58.45,35.05 58,35.5 v57.5,35.5 | v70.5,69 70.5,74 72.5,76 83.25,76 83.75,75.5 83.75,73.73 MOTOR.2
  Bottom 0.25: v57.5,35.5 57.5,42.5 58.5,43.5 64,43.5 67,46.5 67,64.5 70.5,68 v70.5,69
IN2R  (via drill 0.6)
  Top 0.25: IC1.69 67.5,45 68.5,46 77,46 77.5,45.5 82,45.5 82.75,46.25 82.75,47.5 v83,47.75
  Bottom 0.25: v83,47.75 83,50.5 82.55,50.95 MOTOR.4
INT  (via drill 0.6)
  Top 0.25: IC1.7 44.99,45.01 41.5,48.5 38,48.5 v37.5,49 | v34,46.5 34,44 v34.5,43.5 | v35,38 35,30.5 v34.5,30 | v35,28 35,23 v34.5,22.5 | v54.5,8.5 55.5,8.5 56,8 60.5,8 v61,8.5 | v46.5,10.25 46.25,10.25 43.5,7.5 v43.5,4.5 | v47,4.5 47,6 v49.5,8.5
  Bottom 0.25: v37.5,49 36.5,49 v34,46.5 | v34.5,43.5 34.5,38.5 v35,38 | v34.5,30 34.5,28.5 v35,28 | v34.5,22.5 34.5,19.5 37.5,16.5 37.5,15.5 40,13 43.75,13 v46.5,10.25 | v49.5,8.5 v54.5,8.5 | v61,8.5 61,7.51 I2C.10 | v43.5,4.5 v47,4.5
MISO  (via drill 0.6)
  Top 0.25: IC1.22 42.01,37.51 41,36.5 41,24 37.5,20.5 21.25,20.5 20.25,19.5 20.25,6.21 ISP.9 | v80,5 80,3 v79.5,2.5
  Bottom 0.25: SPI2.6 78.74,6.26 v80,5 | v79.5,2.5 78.5,1.5 20,1.5 19,2.5 19,4.96 ISP.9
MOSI  (via drill 0.6)
  Top 0.25: IC1.21 41.51,38.01 40.5,37 40.5,24.5 37,21 20,21 19,20 19,15.24 ISP.1 | SPI2.7 81.28,2.28 80.5,1.5 21.5,1.5 v20.5,2.5
  Bottom 0.25: v20.5,2.5 20.5,13.74 ISP.1
N$1  (via drill 0.6)
  Top 0.25: IC1.87 57.45,57.95 60,60.5 v60.5,60.5
  Bottom 0.25: v60.5,60.5 60.5,66.2 IR.P$3
N$2
  Top 0.25: IC1.98 51.95,56.14 C6.1
N$3
  Top 0.25: IC1.33 54.45,31.16 Q1.2 48.76,29.07 C8.2
N$4
  Top 0.25: IC1.34 55,33.96 55,31 53.5,29.5 53.5,24.5 53.25,24.25 Q1.1 52.29,24.18 48.79,24.18 C7.2
N$5  (via drill 0.6)
  Top 0.25: IC1.1 47.99,48.01 46.5,49.5 46.5,61.5 48,63 51,63 v51.5,62.5 | v57,61 61,65 61,73.62 SERVO.P$3
  Bottom 0.25: v51.5,62.5 54.5,62.5 56,61 v57,61
N$6
  Top 0.25: PC.8 86.37,24.13 70,40.5 IC1.60
N$7
  Top 0.25: IC1.59 69.49,40.01 86.75,22.75 95.14,22.75 PC.7
N$8
  Top 0.25: PC.6 86.91,21.59 69,39.5 IC1.58
N$9
  Top 0.25: IC1.57 68.49,39.01 87.25,20.25 95.18,20.25 PC.5
N$10
  Top 0.25: PC.4 87.45,19.05 68,38.5 IC1.56
N$11
  Top 0.25: IC1.55 67.49,38.01 87.75,17.75 95.22,17.75 PC.3
N$12
  Top 0.25: PC.2 87.99,16.51 67,37.5 IC1.54
N$13
  Top 0.25: IC1.53 66.49,37.01 88.5,15 95.01,15 PC.1
N$14
  Top 0.25: IC1.12 24.73,42.51 PX.1
N$15
  Top 0.25: IC1.13 26.77,42.01 PX.2
N$16
  Top 0.25: IC1.14 29.01,41.51 23,35.5 20.26,35.5 PX.3
N$17
  Top 0.25: IC1.15 29.51,41.01 23,34.5 21.8,34.5 PX.4
N$18
  Top 0.25: IC1.16 30.01,40.51 22.5,33 20.3,33 PX.5
N$19
  Top 0.25: IC1.17 30.51,40.01 22.5,32 21.84,32 PX.6
N$20
  Top 0.25: IC1.18 31.01,39.51 22,30.5 20.34,30.5 PX.7
N$21  (via drill 0.6)
  Top 0.25: PX.8 38.21,29.21 v39,30 | v42,33 47,33 47.5,32.5 51,32.5 51.5,33 51.5,33.96 IC1.27
  Bottom 0.25: v39,30 v42,33
N$22
  Top 0.25: PZ.8 40.25,8.5 43.5,8.5 56.45,21.45 56.45,26.45 58,28 58,33.96 IC1.40
N$23
  Top 0.25: PZ.7 37.94,3.81 36.75,5 36.75,6.75 39,9 43,9 56,22 56,27 57.5,28.5 57.5,33.96 IC1.39
N$24
  Top 0.25: PZ.6 38.71,9.5 42.5,9.5 55.45,22.45 55.45,27.45 57,29 57,33.96 IC1.38
N$25
  Top 0.25: PZ.5 35.56,3.94 34.25,5.25 34.25,6.75 37.5,10 42,10 55,23 55,28 56.5,29.5 56.5,33.96 IC1.37
N$26
  Top 0.25: IC1.36 55.95,29.95 54.5,28.5 54.5,23.5 41.5,10.5 37.17,10.5 PZ.4
N$27
  Top 0.25: IC1.35 55.45,30.45 53.95,28.95 53.95,23.95 41,11 35.25,11 31.75,7.5 31.75,5.08 PZ.3
N$28  (via drill 0.6)
  Top 0.25: PZ.2 30.48,8.98 37.5,16 v42.5,16 | v57,47 58.5,47 60,48.5 60,49.96 IC1.82 | v58.5,20.75 v58.5,25.5
  Bottom 0.25: v42.5,16 50,16 54.75,20.75 v58.5,20.75 | v57,47 56.5,46.5 56.5,35.25 59,32.75 59,26.5 58.5,26 v58.5,25.5
N$29  (via drill 0.6)
  Top 0.25: IC1.83 59.45,48.95 58.5,48 56.25,48 v56,47.75 | v43.5,17 37.5,17 29,8.5 29,5.29 PZ.1 | v57.5,22 v57.5,26.25
  Bottom 0.25: v56,47.75 56,35 58.5,32.5 58.5,27.25 v57.5,26.25 | v43.5,17 50,17 54.75,21.75 57.25,21.75 v57.5,22
N$30
  Top 0.25: IC1.63 70.01,42.01 71,43 73.5,43 78.5,38 95.15,38 PY.1
N$31
  Top 0.25: PY.2 78.13,39.37 74,43.5 70.5,43.5 69.5,42.5 IC1.64
N$32
  Top 0.25: IC1.65 69.01,43.01 70,44 74.5,44 78,40.5 95.11,40.5 PY.3
N$33
  Top 0.25: IC1.66 68.51,43.51 69.5,44.5 75,44.5 77.5,42 93.89,42 PY.4
N$34
  Top 0.25: PY.5 96.2,44.45 95,43.25 77.25,43.25 75.5,45 69,45 68,44 IC1.67
N$35
  Top 0.25: IC1.68 67.76,44.51 68.75,45.5 76,45.5 77,44.5 93.93,44.5 PY.6
N$36  (via drill 0.6)
  Top 0.25: PY.7 96.52,47.48 95.5,48.5 93,48.5 84,57.5 79,57.5 v78.5,57 | v70,57.5 68.5,59 60.5,59 58.5,57 58.5,50.06 IC1.85
  Bottom 0.25: v78.5,57 70.5,57 v70,57.5
N$37  (via drill 0.6)
  Top 0.25: IC1.84 58.95,56.45 61,58.5 67,58.5 v69,56.5 | v78.5,55.5 85,55.5 93.5,47 PY.8
  Bottom 0.25: v69,56.5 77.5,56.5 v78.5,55.5
N$38  (via drill 0.6)
  Top 0.25: IC1.51 63.49,36.01 60,39.5 56,39.5 v55,38.5 | v37.5,59 37,59 21.5,74.5 19.39,74.5 PW.1
  Bottom 0.25: v55,38.5 53.5,38.5 51,41 47.5,41 38.5,50 38.5,56.5 37.5,57.5 v37.5,59
N$39  (via drill 0.6)
  Top 0.25: IC1.52 63.99,36.51 60,40.5 55,40.5 54.5,40 v54.5,39.75 | v38.5,58 37,58 22.5,72.5 20.71,72.5 PW.2
  Bottom 0.25: v54.5,39.75 53.25,39.75 51.5,41.5 48,41.5 39,50.5 39,57.5 v38.5,58
N$40  (via drill 0.6)
  Top 0.25: IC1.70 64.01,45.51 v63.5,45 | v57.75,46 56,46 v54.5,47.5 | v41,53.5 40.5,53.5 22.5,71.5 18.93,71.5 PW.3
  Bottom 0.25: v63.5,45 63,45 62.5,45.5 58.25,45.5 v57.75,46 | v54.5,47.5 47,47.5 v41,53.5
N$41  (via drill 0.6)
  Top 0.25: IC1.28 51.95,35.05 51.5,35.5 50.5,35.5 v50,35 | v25,64 25,60 v38.5,46.5
  Bottom 0.25: v50,35 50,36 39.5,46.5 v38.5,46.5 | PW.4 22.15,70.35 24,68.5 24,65 v25,64
N$42  (via drill 0.6)
  Top 0.25: IC1.29 52.45,35.7 v52.5,35.75 | v23.5,64 24.5,63 24.5,59.5 36.5,47.5 36.5,47 v37,46.5
  Bottom 0.25: v52.5,35.75 51.25,35.75 39.5,47.5 38,47.5 v37,46.5 | PW.5 17.81,67.81 19,69 22,69 23,68 23,64.5 v23.5,64
N$43
  Top 0.25: IC1.4 46.49,46.51 25.5,67.5 20.63,67.5 PW.6
N$44
  Top 0.25: IC1.5 45.99,46.01 25.5,66.5 19.01,66.5 PW.7
N$45
  Top 0.25: IC1.6 45.49,45.51 26,65 20.59,65 PW.8
N$46
  Top 0.25: SPI2.10 JP6.2
N$47  (via drill 0.6)
  Top 0.25: IC1.47 61.45,23.05 69,15.5 69,7 v68.5,6.5
  Bottom 0.25: v68.5,6.5 73.51,6.5 SPI2.2
N$48
  Top 0.25: SPI2.4 76.2,5.8 77.5,4.5 77.5,3 76.5,2 72.5,2 69.5,5 69.5,16 62,23.5 62,33.96 IC1.48
N$49
  Top 0.25: IC1.50 62.95,24.55 70.5,17 70.5,6.97 SPI2.1
N$50  (via drill 0.6)
  Top 0.25: LED3.C 36.97,36.97 v36.5,36.5 | v42.5,36.5 43,37 IC1.23
  Bottom 0.25: v36.5,36.5 v42.5,36.5
N$51
  Top 0.25: IC1.72 67.51,46.51 68,47 78.96,47 LED2.C
N$52
  Top 0.25: IC1.71 67.76,46.01 68.25,46.5 78,46.5 78.5,46 80.79,46 LED1.C
N$53
  Top 0.25: SPI2.3 75.81,3.81 74.5,2.5 73,2.5 70,5.5 70,16.5 62.5,24 62.5,33.96 IC1.49
N$54
  Top 0.25: ISP.2 26.68,15.18 JP1.2
N$55  (via drill 0.6)
  Top 0.25: I2C.7 I2C.5 v58.5,5.21 | v56.99,9.01 JP2.1
  Bottom 0.25: v56.99,9.01 58.5,7.5 v58.5,5.21
N$56
  Top 0.25: JP3.1 65.99,7.62 I2C.9
N$57
  Top 0.25: JP4.2 MOTOR.10
N$58  (via drill 0.6)
  Top 0.25: IC1.90 55.95,61.95 v56.5,62.5
  Bottom 0.25: v56.5,62.5 55.5,62.5 54,64 47.5,64 46,65.5 40,65.5 37,68.5 35.5,68.5 32.5,71.5 32.5,71.64 ADC.8
N$59
  Top 0.25: LED1.A 81.72,48.72 82,49 84.26,49 R2.1
N$60
  Top 0.25: LED2.A 79.03,48.53 80,49.5 87.27,49.5 R5.1
N$61
  Top 0.25: LED3.A 37.96,33.88 R6.1
N$62  (via drill 0.6)
  Top 0.25: IC1.91 55.45,63.45 v56,64
  Bottom 0.25: v56,64 55,64 54.5,64.5 48,64.5 46.5,66 40.5,66 37.5,69 36,69 33,72 33,73.68 ADC.7
N$63  (via drill 0.6)
  Top 0.25: IC1.92 54.95,64.7 v55.5,65.25
  Bottom 0.25: v55.5,65.25 48.25,65.25 47,66.5 41,66.5 38,69.5 36.5,69.5 34.5,71.5 34.5,72.18 ADC.6
N$64  (via drill 0.8)
  Top 0.61: D1.C 3.63,43 H1.P$1 6.5,41.88 v6.5,39
  Bottom 0.61: LM2576-5.P$2 9.32,36.18 v6.5,39
N$65  (via drill 0.6)
  Top 0.25: IC1.93 54.45,65.95 v55,66.5
  Bottom 0.25: v55,66.5 54.5,66 48.5,66 47.5,67 41.5,67 38.5,70 37,70 35.5,71.5 35.5,73.72 ADC.5
N$66  (via drill 0.6)
  Top 0.25: IC1.94 53.95,65.55 53,66.5 v53,67
  Bottom 0.25: v53,67 52.5,66.5 49,66.5 48,67.5 42,67.5 39,70.5 38,70.5 37,71.5 37,72.22 ADC.4
N$67  (via drill 0.6)
  Top 0.25: IC1.95 53.45,65.05 52,66.5 v52,68
  Bottom 0.25: v52,68 52,67.5 51.5,67 49.5,67 48.5,68 42.5,68 39.5,71 38.5,71 38,71.5 38,73.76 ADC.3
N$68  (via drill 0.6)
  Top 0.25: IC1.96 52.95,64.55 50.5,67 v50.5,68
  Bottom 0.25: v50.5,68 49.5,68 49,68.5 43.26,68.5 ADC.2
N$69
  Top 0.25: ADC.1 40.57,74.93 52.5,63 52.5,50.06 IC1.97
N$70
  Top 2: 20,-1 -1,-1 -1,20
N$71  (via drill 0.6)
  Top 0.25: IC1.46 60.95,22.55 64,19.5 64,18 v63.5,17.5
  Bottom 0.25: v63.5,17.5 69,23 JP9.2
N$72  (via drill 0.6)
  Top 0.25: v64,15 62.5,16.5 62.5,20 60.5,22 60.5,33.96 IC1.45
  Bottom 0.25: JP9.1 69.96,20.46 64.5,15 v64,15
N$73
  Top 2: 80,-1 101,-1 101,20
N$74
  Top 2: 20,79 -1,79 -1,58
N$75
  Top 2: 101,58 101,79 80,79
N$76
  Bottom 2: 20,-1 -1,-1 -1,20
N$77
  Bottom 2: 80,-1 101,-1 101,20
N$78
  Bottom 2: 20,79 -1,79 -1,58
N$79
  Bottom 2: 101,58 101,79 80,79
N$80
  Top 0.61: LM2576-5.P$4 5.92,31.42 8.5,34 8.5,39 10.5,41 10.5,43 13,45.5 19.25,45.5 C10.1 19.47,48.1 C12.+ | H1.P$2 8.97,58.6 C12.+ | JP5.2 12,57.5 16.5,53 16.5,51.07 C12.+
PWML  (via drill 0.6)
  Top 0.25: IC1.25 51.51,36.01 v52.5,37 | v54.5,36 55,36 56,37 58.5,37 v59,36.5
  Bottom 0.25: v52.5,37 53,37 53.25,36.75 53.75,36.75 v54.5,36 | v59,36.5 78,36.5 80.5,39 80.5,71.9 MOTOR.6
PWMR  (via drill 0.6)
  Top 0.25: IC1.24 50.76,36.51 v52.5,38.25 | v54.5,37.25 55.25,37.25 56,38 v59,38 | v79.5,70.5 79.36,70.5 MOTOR.8
  Bottom 0.25: v52.5,38.25 52.75,38.25 53,38 53.75,38 v54.5,37.25 | v59,38 59.5,38 60.5,37 77.5,37 80,39.5 80,70 v79.5,70.5
READIMG
  Top 0.25: IC1.78 61.95,51.45 62.5,52 67,52 83.5,68.5 95.17,68.5 GB_CAM.7
RESET  (via drill 0.6)
  Top 0.25: IC1.30 53,33.96 53,33 53,32.5 52.5,32 47,32 46.8,32.2 R1.1 45.39,32 42.5,32 41.5,31 41.5,23.5 38,20 22.5,20 v22,19.5
  Bottom 0.25: ISP.5 18.4,10.1 17.5,11 17.5,18.5 19,20 21.5,20 v22,19.5
RX
  Top 0.25: IC1.2 47.49,47.51 44.5,50.5 44.5,62.9 BT.1
SCK  (via drill 0.6)
  Top 0.25: ISP.7 17.94,7.56 17,8.5 17,20 18.5,21.5 36.5,21.5 40,25 | 40,25 40,37.5 41,38.5 IC1.20 | 40,25 39,25 v38.5,25.5 | v64.5,8.5 63.5,7.5 53.5,7.5 52.75,8.25 v52.75,12.5
  Bottom 0.25: v38.5,25.5 38.5,18.5 38,18 38,16 40.5,13.5 51.75,13.5 v52.75,12.5 | v64.5,8.5 79.13,8.5 SPI2.8
SCL
  Top 0.25: 56.5,17.5 56.5,19 57,19.5 59,19.5 59.45,19.95 IC1.43 | 56.5,17.5 57.5,16.5 57.71,16.5 R3.2 | I2C.1 52.01,3.99 50.5,5.5 50.5,11.5 56.5,17.5
SDA
  Top 0.25: I2C.3 54.7,3.8 56,2.5 62.5,2.5 63.5,3.5 63.5,4 66.5,7 66.5,9.5 67.5,10.5 67.5,13 66.5,14 63.25,14 61.12,16.12 | 61.12,16.12 R4.2 | IC1.44 59.95,21.55 62,19.5 62,17 61.12,16.12
SENSL  (via drill 0.6)
  Top 0.25: IC1.88 56.95,58.45 60,61.5 66,61.5 72,67.5 72,70.5 v72.5,71
  Bottom 0.25: v72.5,71 78.25,71 78.75,71.5 78.75,73.67 MOTOR.5
SENSR
  Top 0.25: MOTOR.7 77.43,74.93 76,73.5 73,73.5 71.5,72 71.5,68 65.5,62 59.5,62 56.5,59 56.5,50.06 IC1.89
SERVO  (via drill 0.6)
  Top 0.25: IC1.26 50.51,34.01 v50,33.5 | v64,25 64,32.5 v66.5,35 | v78,35 89.5,35 v91,36.5 | v91.5,51.5 91.5,60.75 v91,61.25
  Bottom 0.25: v50,33.5 51.5,33.5 55.5,29.5 55.5,25.5 57,24 63,24 v64,25 | v66.5,35 v78,35 | v91,36.5 91,51 v91.5,51.5 | v91,61.25 91,69.41 GB_CAM.10
SS  (via drill 0.6)
  Top 0.25: SPI2.5 78.74,4.26 77.5,5.5 77.5,9.5 v72,15 | v39.5,18 32.5,18 v31.5,19 | v32,30.5 32,38.5 32.5,39 IC1.19
  Bottom 0.25: v72,15 71.5,14.5 67,14.5 66.5,14 41,14 40,15 40,17.5 v39.5,18 | v31.5,19 31.5,30 v32,30.5
START
  Top 0.25: GB_CAM.2 82.23,62.23 67,47 IC1.73
SYSRES
  Top 0.25: GB_CAM.5 96.52,67.02 95.5,66 83,66 68,51 63.5,51 63,50.5 63,50.06 IC1.76
TX
  Top 0.25: IC1.3 46.99,47.01 42,52 BT.2
VCC  (via drill 0.6)
  Top 0.25: R2.2 R5.2 89.6,46.9 90.75,45.75 97.75,45.75 98,46 | 59,18.36 57.91,18.36 R3.1 | 59,18.36 R4.1 | JP2.2 54.45,13.95 56,15.5 58.5,15.5 59,16 59,18.36 | v61,56.5 61.83,55.67 C4.1 60.95,52.68 IC1.80 60.95,41.05 64.91,41.05 IC1.61 | v47.5,55.5 47.5,53 48,52.5 49.74,52.5 C5.1 50.95,51.93 IC1.100 51,49.96 51,47 53.25,44.75 53.25,43.25 | GB_CAM.1 96.52,61.52 94,59 94,51 | 94,51 94,49.55 PY.10 | 98,46 98,50.5 97.5,51 94,51 | 92.5,27 93.65,27 PC.10 | v85,28 85,27.5 84.5,27 | R6.2 36.21,30.79 v37,30 | v43,30 45.09,30 R1.2 45.78,30.69 C2.1 48.18,31.5 53,31.5 53.45,31.95 IC1.31 53.45,39.95 54.5,41 | 54.5,41 60.9,41 | 53.25,43.25 53.25,41.5 53.75,41 54.5,41 | IC1.61 | IC1.61 70.49,41.01 71,40.5 71.68,40.5 C3.1 71.96,39.54 84.5,27 | C1.2 44.89,43.51 IC1.10 52.99,43.51 53.25,43.25 | 84.5,27 92.5,27 | 92.5,27 98,32.5 98,46 | BT.4 36.92,64.68 ADC.10 | JP1.1 28.39,12.89 29.5,14 29.5,18 v28.5,19 | PX.10 25.76,22.5 v28,22.5 32,22.5 v33.5,24 | ENC.4 64.7,76.2 64,75.5 64,73 v62,71 | v73.25,72.25 73.75,71.75 73.75,65.75 74.5,65 75.16,65 JP4.1
  Top 0.305: SERVO.P$2 59.69,72.19 58.5,71 55.5,71 53.5,69 48,69 v47.5,69.5 | v44,70 42.25,70 38.25,66 38.25,60.75 v38,60.5 | 20.32,60.5 v22.5,60.5
  Top 0.406: C1.2 36.5,45.5 29,53 21,53 20.75,53.25 20.32,53.68 20.32,60.5 PW.10 | C11.2 23.65,59.35 v22.5,60.5
  Top 0.61: JP5.1 14.23,62.77 15.5,61.5 15.5,56 18,53.5 20.5,53.5 20.75,53.25
  Bottom 0.25: JP1.1 38.11,12.89 40.5,10.5 40.5,6.49 PZ.10 40.79,6.5 44,6.5 48.98,11.48 JP2.2 54.45,13 54.95,13.5 77,13.5 79.07,11.43 JP6.1 | 59.5,56.5 48.5,56.5 v47.5,55.5 | 59.5,56.5 v61,56.5 | 59.5,56.5 59.69,56.69 IR.P$2 59.69,69 61.69,71 v62,71 | JP9.4 84.92,28.08 v85,28 | v43,30 42.5,30 41.5,29 38.5,29 37.5,30 v37,30 37,26 35,24 v33.5,24 | BT.4 20.53,62.94 PW.10 | v28.5,19 28.5,22 v28,22.5 | ENC.4 70.3,76.2 71,75.5 71,74.5 v73.25,72.25
  Bottom 0.305: v47.5,69.5 44.5,69.5 v44,70 | v22.5,60.5 v38,60.5